# EAGLE design microSD Connector (EAGLE 8.3.0)
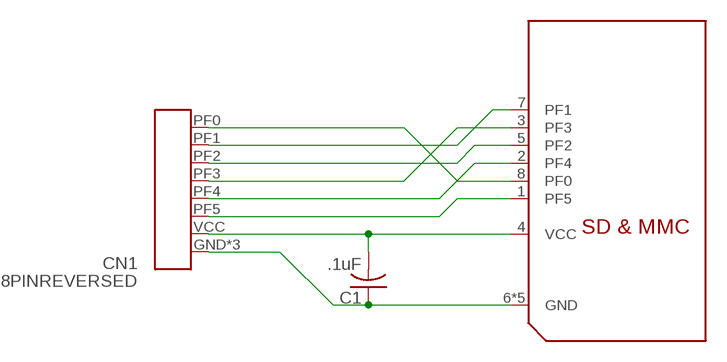
[diagram p0: schematic, sheet 1]

## Parts
C1  .1uF  C-USC0805K  [C0805K]
CN1  8PINREVERSED  [SFV8R-3STBE1HLF-REVERSED]
U$1  MICROSD  [MICROSD]

## Nets
GND: C1.1 CN1.GND CN1.GNDP1(GND) CN1.GNDP2(GND) U$1.6(GND) U$1.CD1(GND) U$1.CD2(GND) U$1.MT1(GND) U$1.MT2(GND)
N$1: CN1.PF0 U$1.8(PF0)
N$2: CN1.PF1 U$1.7(PF1)
N$3: CN1.PF2 U$1.5(PF2)
N$4: CN1.PF3 U$1.3(PF3)
N$5: CN1.PF4 U$1.2(PF4)
N$6: CN1.PF5 U$1.1(PF5)
VCC: C1.2 CN1.VCC U$1.4(VCC)

## Library data of the parts
C1 = adafruit:C-US: CAPACITOR, American symbol
CN1 = nintendo-classic:8PIN
U$1 = nintendo-classic:MICROSD

## Board
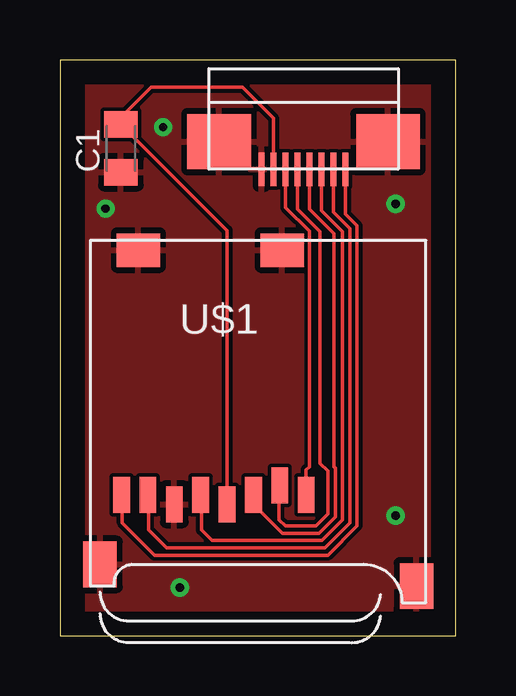
[diagram p1: board, top side]
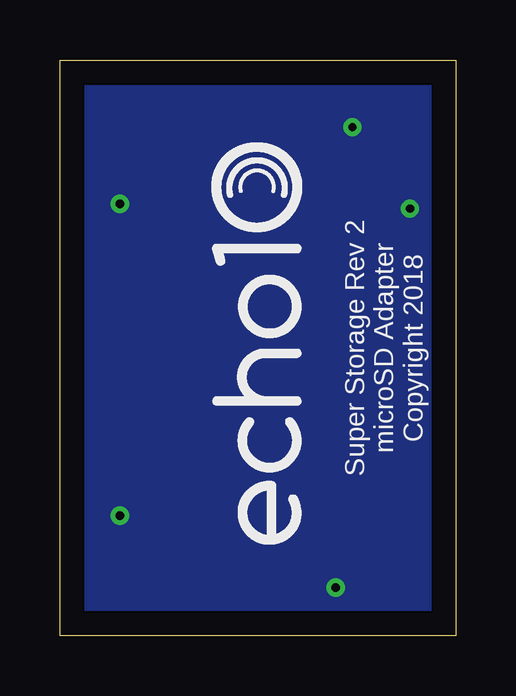
[diagram p2: board, bottom side, seen from below]

Size 16.5 x 24 mm. Coordinates in mm from the lower left corner, seen from the top.
Outline: 0,0 16.5,0 16.5,24 0,24 0,0
Copper layers (1*16): Top 0.035mm / dielectric 1.5mm / Bottom 0.035mm
Design rules "default": minimum track width 6mil, minimum drill 0.35mm, track to track 6mil, track to pad 6mil, pad to pad 6mil, via to via 6mil, smd to smd 6mil, copper to edge 40mil, drill to drill 6mil, minimum pad ring 10mil, minimum via ring 8mil, stop-mask expansion 4mil, vias tented up to drill 0mil, thermal gap 10mil

### Footprints (pad centres in the part's own frame; a part is rotated, then mirrored left to right if it is on the bottom)
C0805K = smd 1.1 x 1.4: 1 -1,0; 2 1,0
SFV8R-3STBE1HLF-REVERSED = smd 0.25 x 1.4: GND 1.75,2.15; PF0 -1.75,2.15; PF1 -1.25,2.15; PF2 -0.75,2.15; PF3 -0.25,2.15; PF4 0.25,2.15; PF5 0.75,2.15; VCC 1.25,2.15 | smd 2.65 x 2.3: GNDP1 -3.525,1; GNDP2 3.525,1
MICROSD = smd 0.7 x 1.5: 1 9,-10.64; 2 7.9,-10.24; 3 6.8,-10.64; 4 5.7,-11.04; 5 4.6,-10.64; 6 3.5,-11.04; 7 2.4,-10.64; 8 1.3,-10.64 | smd 1.8 x 1.4: CD1 2,-0.44; CD2 8,-0.44 | smd 1.4 x 1.9: MT1 0.4,-13.54; MT2 13.6,-14.44

### Placement (x,y rotation side)
C1  2.54,20.32 90 top
CN1  10.16,21.59 180 top
U$1  1.27,16.51 0 top

### Tracks (layer width: path | path; a pad name or v marks a point on that pad's centre or on a via)
GND  (via drill 0.35)
  other vias: 5,2 1.9,17.8 14,18 14,5 4.3,21.2
  pour Bottom: -3,26 -3,-3 19,-3 19,26
  pour Top: -2,25 -2,-2 18,-2 18,25
N$1
  Top 0.152: CN1.PF0 11.91,17.58 12.39,17.09 12.39,4.58 11.17,3.35 3.95,3.35 2.6,4.7 2.6,5.84 U$1.8
N$2
  Top 0.152: CN1.PF1 11.41,17.65 12.09,16.97 12.09,4.7 11.05,3.66 4.44,3.66 3.7,4.4 3.7,5.84 U$1.7
N$3
  Top 0.152: CN1.PF2 10.91,17.71 11.79,16.84 11.79,4.83 10.92,3.96 6.34,3.96 5.9,4.4 5.9,5.84 U$1.5
N$4
  Top 0.152: CN1.PF3 10.41,17.78 11.43,16.76 11.43,7.04 11.48,6.98 11.48,4.95 10.79,4.27 9.27,4.27 8.21,5.33 8.13,5.33 8.13,5.81 U$1.3
N$5
  Top 0.152: CN1.PF4 9.91,17.78 10.85,16.85 10.85,7.18 11.18,6.86 11.18,5.08 10.67,4.57 9.4,4.57 9.14,4.83 9.14,6.24 U$1.2
N$6
  Top 0.152: CN1.PF5 9.41,17.85 10.4,16.86 10.4,7.04 10.27,6.91 U$1.1
VCC
  Top 0.152: CN1.VCC 8.91,21.57 7.62,22.86 3.81,22.86 2.54,21.59 C1.2 6.97,16.89 U$1.4

### Text on the board
tPlace: Super Storage | Super Storage
bPlace: Super Storage Rev 2 / microSD Adapter / Copyright 2018